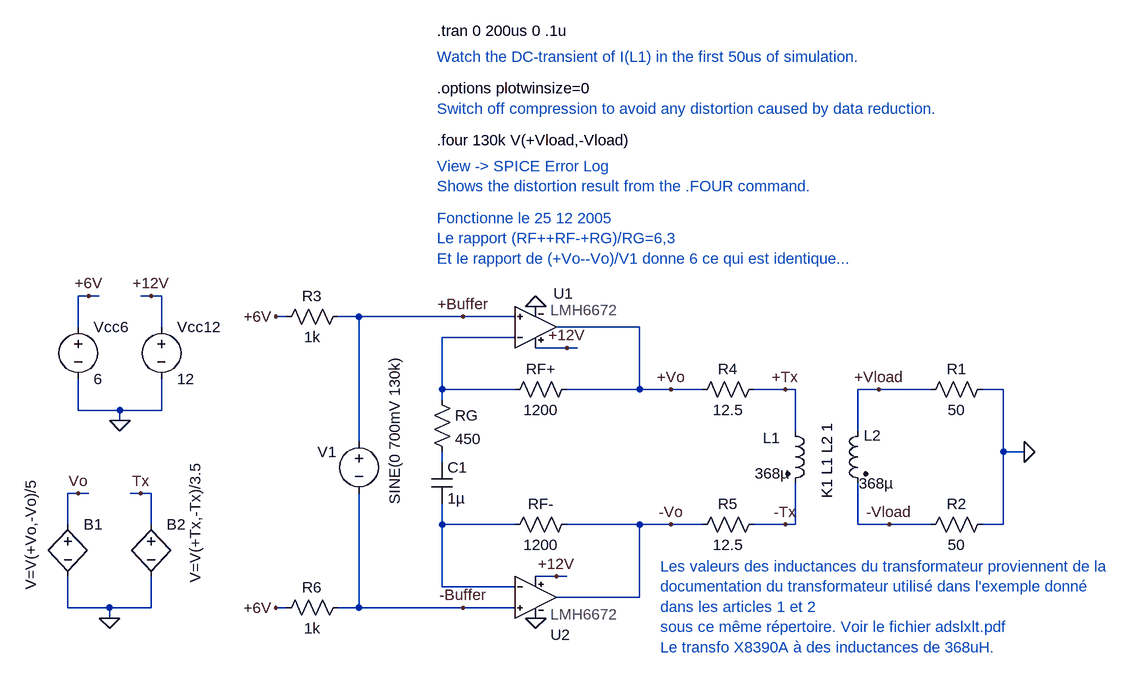
[diagram p0: schematic ADSL_Line_Driver_LMH6672b.asc]
ADSL_Line_Driver_LMH6672b.asc, the LTspice schematic file:
Version 4
SHEET 1 1396 680
WIRE -320 256 -320 208
WIRE -320 384 -320 336
WIRE -304 -48 -304 -96
WIRE -304 80 -304 32
WIRE -304 208 -320 208
WIRE -288 -96 -304 -96
WIRE -288 208 -304 208
WIRE -272 -96 -288 -96
WIRE -256 384 -320 384
WIRE -256 400 -256 384
WIRE -240 80 -304 80
WIRE -240 96 -240 80
WIRE -208 208 -224 208
WIRE -192 -96 -208 -96
WIRE -192 208 -208 208
WIRE -192 256 -192 208
WIRE -192 384 -256 384
WIRE -192 384 -192 336
WIRE -176 -96 -192 -96
WIRE -176 -48 -176 -96
WIRE -176 80 -240 80
WIRE -176 80 -176 32
WIRE 16 -64 0 -64
WIRE 16 384 0 384
WIRE 128 -64 96 -64
WIRE 128 128 128 -64
WIRE 128 384 96 384
WIRE 128 384 128 208
WIRE 256 48 256 -32
WIRE 256 64 256 48
WIRE 256 160 256 144
WIRE 256 256 256 224
WIRE 256 352 256 256
WIRE 288 -64 128 -64
WIRE 288 384 128 384
WIRE 368 -64 288 -64
WIRE 368 -32 256 -32
WIRE 368 48 256 48
WIRE 368 256 256 256
WIRE 368 352 256 352
WIRE 368 384 288 384
WIRE 432 336 400 336
WIRE 448 -16 400 -16
WIRE 448 336 432 336
WIRE 464 -16 448 -16
WIRE 560 -48 432 -48
WIRE 560 48 448 48
WIRE 560 48 560 -48
WIRE 560 256 448 256
WIRE 560 368 432 368
WIRE 560 368 560 256
WIRE 608 48 560 48
WIRE 608 256 560 256
WIRE 656 48 608 48
WIRE 656 256 608 256
WIRE 784 48 736 48
WIRE 784 256 736 256
WIRE 800 48 784 48
WIRE 800 112 800 48
WIRE 800 256 784 256
WIRE 800 256 800 192
WIRE 896 112 896 48
WIRE 896 256 896 192
WIRE 928 48 896 48
WIRE 944 256 896 256
WIRE 1008 48 928 48
WIRE 1008 256 944 256
WIRE 1120 48 1088 48
WIRE 1120 144 1120 48
WIRE 1120 256 1088 256
WIRE 1120 256 1120 144
WIRE 1152 144 1120 144
FLAG -240 96 0
FLAG -192 -96 +12V
FLAG -288 -96 +6V
FLAG 400 -80 0
FLAG 288 -64 +Buffer
FLAG 288 384 -Buffer
FLAG 448 -16 +12V
FLAG 432 336 +12V
FLAG 400 400 0
FLAG 1152 144 0
FLAG 608 48 +Vo
FLAG 608 256 -Vo
FLAG 928 48 +Vload
FLAG 944 256 -Vload
FLAG 784 48 +Tx
FLAG 784 256 -Tx
FLAG -256 400 0
FLAG -208 208 Tx
FLAG -304 208 Vo
FLAG 0 -64 +6V
FLAG 0 384 +6V
SYMBOL voltage -176 -64 R0
WINDOW 123 0 0 Left 0
WINDOW 39 0 0 Left 0
SYMATTR InstName Vcc12
SYMATTR Value 12
SYMBOL voltage -304 -64 R0
WINDOW 123 0 0 Left 0
WINDOW 39 0 0 Left 0
SYMATTR InstName Vcc6
SYMATTR Value 6
SYMBOL voltage 128 112 R0
WINDOW 123 24 132 Left 0
WINDOW 39 0 0 Left 0
WINDOW 0 -64 32 Left 0
WINDOW 3 55 -115 VRight 0
SYMATTR InstName V1
SYMATTR Value SINE(0 700mV 130k)
SYMBOL res 240 48 R0
SYMATTR InstName RG
SYMATTR Value 450
SYMBOL res 464 32 R90
WINDOW 0 0 56 VBottom 0
WINDOW 3 32 56 VTop 0
SYMATTR InstName RF+
SYMATTR Value 1200
SYMBOL res 464 240 R90
WINDOW 0 0 56 VBottom 0
WINDOW 3 32 56 VTop 0
SYMATTR InstName RF-
SYMATTR Value 1200
SYMBOL res 752 32 R90
WINDOW 0 0 56 VBottom 0
WINDOW 3 32 56 VTop 0
SYMATTR InstName R4
SYMATTR Value 12.5
SYMBOL res 752 240 R90
WINDOW 0 0 56 VBottom 0
WINDOW 3 32 56 VTop 0
SYMATTR InstName R5
SYMATTR Value 12.5
SYMBOL cap 240 160 R0
SYMATTR InstName C1
SYMATTR Value 1µ
SYMBOL ind2 784 96 R0
WINDOW 0 -34 27 Left 0
WINDOW 3 -47 81 Left 0
SYMATTR InstName L1
SYMATTR Value 368µ
SYMATTR Type ind
SYMBOL ind2 912 96 M0
WINDOW 0 -20 23 Left 0
WINDOW 3 -39 97 Left 0
SYMATTR InstName L2
SYMATTR Value 368µ
SYMATTR Type ind
SYMBOL res 1104 240 R90
WINDOW 0 0 56 VBottom 0
WINDOW 3 32 56 VTop 0
SYMATTR InstName R2
SYMATTR Value 50
SYMBOL LMH6672 400 -48 M180
WINDOW 0 27 52 Left 0
SYMATTR InstName U1
SYMBOL LMH6672 400 368 R0
WINDOW 0 23 58 Left 0
SYMATTR InstName U2
SYMBOL bv -320 240 R0
WINDOW 3 -57 117 VLeft 0
SYMATTR Value V=V(+Vo,-Vo)/5
SYMATTR InstName B1
SYMBOL bv -192 240 R0
WINDOW 3 68 106 VLeft 0
SYMATTR Value V=V(+Tx,-Tx)/3.5
SYMATTR InstName B2
SYMBOL res 0 -48 R270
WINDOW 0 32 56 VTop 0
WINDOW 3 0 56 VBottom 0
SYMATTR InstName R3
SYMATTR Value 1k
SYMBOL res 0 400 R270
WINDOW 0 32 56 VTop 0
WINDOW 3 0 56 VBottom 0
SYMATTR InstName R6
SYMATTR Value 1k
SYMBOL res 1104 32 R90
WINDOW 0 0 56 VBottom 0
WINDOW 3 32 56 VTop 0
SYMATTR InstName R1
SYMATTR Value 50
TEXT 848 216 VLeft 0 !K1 L1 L2 1
TEXT 248 -216 Left 0 ;Fonctionne le 25 12 2005\nLe rapport (RF++RF-+RG)/RG=6,3\nEt le rapport de (+Vo--Vo)/V1 donne 6 ce qui est identique...
TEXT 592 320 Left 0 ;Les valeurs des inductances du transformateur proviennent de la \ndocumentation du transformateur utilisé dans l'exemple donné \ndans les articles 1 et 2\nsous ce même répertoire. Voir le fichier adslxlt.pdf \nLe transfo X8390A à des inductances de 368uH.
TEXT 248 -504 Left 0 !.tran 0 200us 0 .1u  
TEXT 248 -416 Left 0 !.options plotwinsize=0
TEXT 248 -336 Left 0 !.four 130k V(+Vload,-Vload)
TEXT 248 -296 Left 0 ;View -> SPICE Error Log \nShows the distortion result from the .FOUR command.
TEXT 248 -464 Left 0 ;Watch the DC-transient of I(L1) in the first 50us of simulation.
TEXT 248 -384 Left 0 ;Switch off compression to avoid any distortion caused by data reduction.

The netlist it stands for:
* ADSL_Line_Driver_LMH6672b.asc
Vcc12 +12V 0 12
Vcc6 +6V 0 6
V1 +Buffer -Buffer SINE(0 700mV 130k)
RG N001 N002 450
RF+ +Vo N001 1200
RF- -Vo N003 1200
R4 +Tx +Vo 12.5
R5 -Tx -Vo 12.5
C1 N002 N003 1µ
L1 +Tx -Tx 368µ
L2 +Vload -Vload 368µ
R2 0 -Vload 50
XU1 N001 +Buffer +12V 0 +Vo LMH6672  ; pins In- In+ V+ V- OUT
XU2 N003 -Buffer +12V 0 -Vo LMH6672  ; pins In- In+ V+ V- OUT
B1 Vo 0 V=V(+Vo,-Vo)/5
B2 Tx 0 V=V(+Tx,-Tx)/3.5
R3 +6V +Buffer 1k
R6 +6V -Buffer 1k
R1 0 +Vload 50
K1 L1 L2 1
* Fonctionne le 25 12 2005
* Le rapport (RF++RF-+RG)/RG=6,3
* Et le rapport de (+Vo--Vo)/V1 donne 6 ce qui est identique...
* Les valeurs des inductances du transformateur proviennent de la
* documentation du transformateur utilisé dans l'exemple donné
* dans les articles 1 et 2
* sous ce même répertoire. Voir le fichier adslxlt.pdf
* Le transfo X8390A à des inductances de 368uH.
.tran 0 200us 0 .1u
.options plotwinsize=0
.four 130k V(+Vload,-Vload)
* View -> SPICE Error Log
* Shows the distortion result from the .FOUR command.
* Watch the DC-transient of I(L1) in the first 50us of simulation.
* Switch off compression to avoid any distortion caused by data reduction.
.lib nationalhighspeed.lib
.backanno
.end